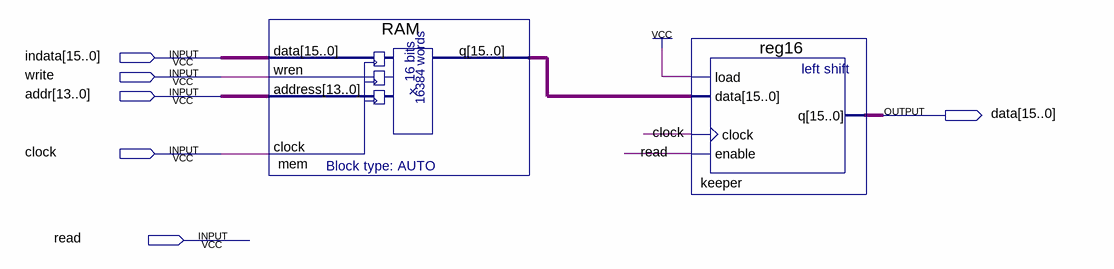
[diagram p0: schematic sheet]
// Quartus schematic RAMHolder.bdf as structural Verilog: 2 symbols, 6 pins
module RAMHolder (
  input  [15:0] indata,
  input  write,
  input  [13:0] addr,
  input  clock,
  input  read,
  output [15:0] data
);

  wire [15:0] mem_q;

  RAM mem (.data(indata), .wren(write), .address(addr), .clock(clock), .q(mem_q));
  reg16 keeper (.load(1'b1), .data(mem_q), .clock(clock), .enable(read), .q(data));
endmodule
